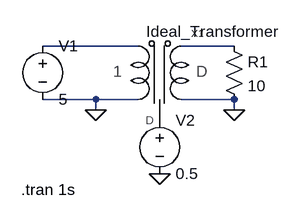
[diagram p0: schematic test_ideal_transformer.asc]
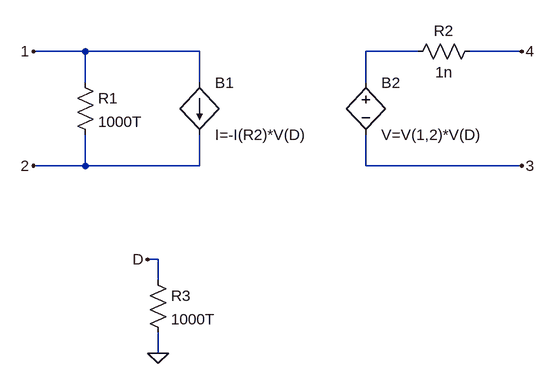
[diagram p1: sub-circuit ideal_transformer.asc]
test_ideal_transformer.asc, the LTspice schematic file:
Version 4
SHEET 1 880 680
WIRE 160 144 16 144
WIRE 304 144 224 144
WIRE 96 224 16 224
WIRE 160 224 96 224
WIRE 304 224 224 224
WIRE 96 240 96 224
WIRE 304 240 304 224
FLAG 192 336 0
FLAG 96 240 0
FLAG 304 240 0
SYMBOL voltage 16 128 R0
WINDOW 123 0 0 Left 0
WINDOW 39 0 0 Left 0
SYMATTR InstName V1
SYMATTR Value 5
SYMBOL res 288 128 R0
SYMATTR InstName R1
SYMATTR Value 10
SYMBOL voltage 192 240 R0
WINDOW 123 0 0 Left 0
WINDOW 39 0 0 Left 0
SYMATTR InstName V2
SYMATTR Value 0.5
SYMBOL ideal_transformer 144 128 R0
SYMATTR InstName X1
TEXT -16 360 Left 2 !.tran 1s

ideal_transformer.asc, the sub-circuit schematic file:
Version 4
SHEET 1 880 680
WIRE -192 80 -272 80
WIRE -16 80 -192 80
WIRE 320 80 240 80
WIRE 480 80 400 80
WIRE -192 128 -192 80
WIRE -16 128 -16 80
WIRE 240 128 240 80
WIRE -192 256 -192 208
WIRE -192 256 -272 256
WIRE -16 256 -16 208
WIRE -16 256 -192 256
WIRE 240 256 240 208
WIRE 480 256 240 256
WIRE -80 400 -96 400
WIRE -80 432 -80 400
WIRE -80 544 -80 512
FLAG -80 544 0
FLAG -96 400 D
FLAG -272 80 1
FLAG -272 256 2
FLAG 480 80 4
FLAG 480 256 3
SYMBOL res -208 112 R0
SYMATTR InstName R1
SYMATTR Value 1000T
SYMBOL res 416 64 R90
WINDOW 0 0 56 VBottom 2
WINDOW 3 32 56 VTop 2
SYMATTR InstName R2
SYMATTR Value 1n
SYMBOL bi -16 128 R0
SYMATTR InstName B1
SYMATTR Value I=-I(R2)*V(D)
SYMBOL res -96 416 R0
SYMATTR InstName R3
SYMATTR Value 1000T
SYMBOL bv 240 112 R0
SYMATTR InstName B2
SYMATTR Value V=V(1,2)*V(D)

The netlist it stands for:
* test_ideal_transformer.asc
V1 N001 0 5
R1 N002 0 10
V2 P001 0 0.5
XX1 N001 0 0 N002 P001 ideal_transformer params: Ideal_Transformer

* block symbol definitions
.subckt ideal_transformer 1 2 3 4 D
R1 1 2 1000T
R2 4 N001 1n
B1 1 2 I=-I(R2)*V(D)
R3 D 0 1000T
B2 N001 3 V=V(1,2)*V(D)
.ends ideal_transformer

.tran 1s
.backanno
.end